# Altium schematic sheet MODELO TRANSFORMADOR.SCHDOC
size A
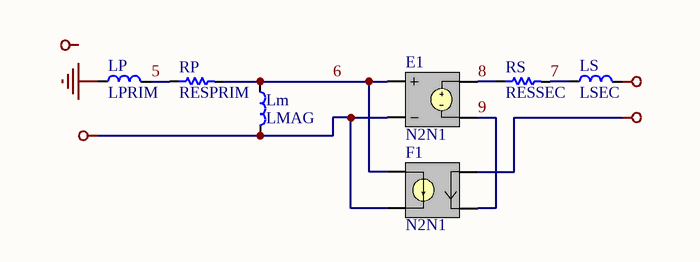
[diagram p0: MODELO TRANSFORMADOR.SCHDOC]

## Parts
E1  Gain: N2N1  (hidden comment: ESRC)
F1  Gain: N2N1  (hidden comment: FSRC)
Lm  value LMAG  [TOROIDE TN14-9-5]  (hidden comment: Inductor2)
LP  value LPRIM  [TOROIDE TN14-9-5]  (hidden comment: Inductor2)
LS  value LSEC  [TOROIDE TN14-9-5]  (hidden comment: Inductor2)
RP  value RESPRIM  [0805]  (hidden comment: Res)
RS  value RESSEC  [0805]  (hidden comment: Res)

## Nets
2: E1.2(NC-) F1.4(N-) Lm.2
3: LS.2
4: F1.1(NC+)
GND: LP.1
5: LP.2 RP.1
6: E1.1(NC+) F1.3(N+) Lm.1 RP.2
7: LS.1 RS.2
8: E1.3(N+) RS.1
9: E1.4(N-) F1.2(NC-)

## Notes on the sheet
- Labels drawn without touching a wire or pin: 1

## Library data of the parts
E1 = ESRC: Voltage Controlled Voltage Source; Note: PCB Footprint - Not required; Published: 8-Jun-2000; Revision: 17-Jul-2002: Re-released for DXP Platform.; Package Reference: Not Applicable; Publisher: Altium Limited
F1 = FSRC: Current Controlled Current Source; Note: PCB Footprint - Not required; Published: 8-Jun-2000; Revision: 17-Jul-2002: Re-released for DXP Platform.; Package Reference: Not Applicable; Publisher: Altium Limited
Lm LP LS = Inductor2: Inductor; Revision: July-2002: Re-released for DXP Platform.
RP RS = Res: Resistor; Power: 0.25W; Price: 0.036